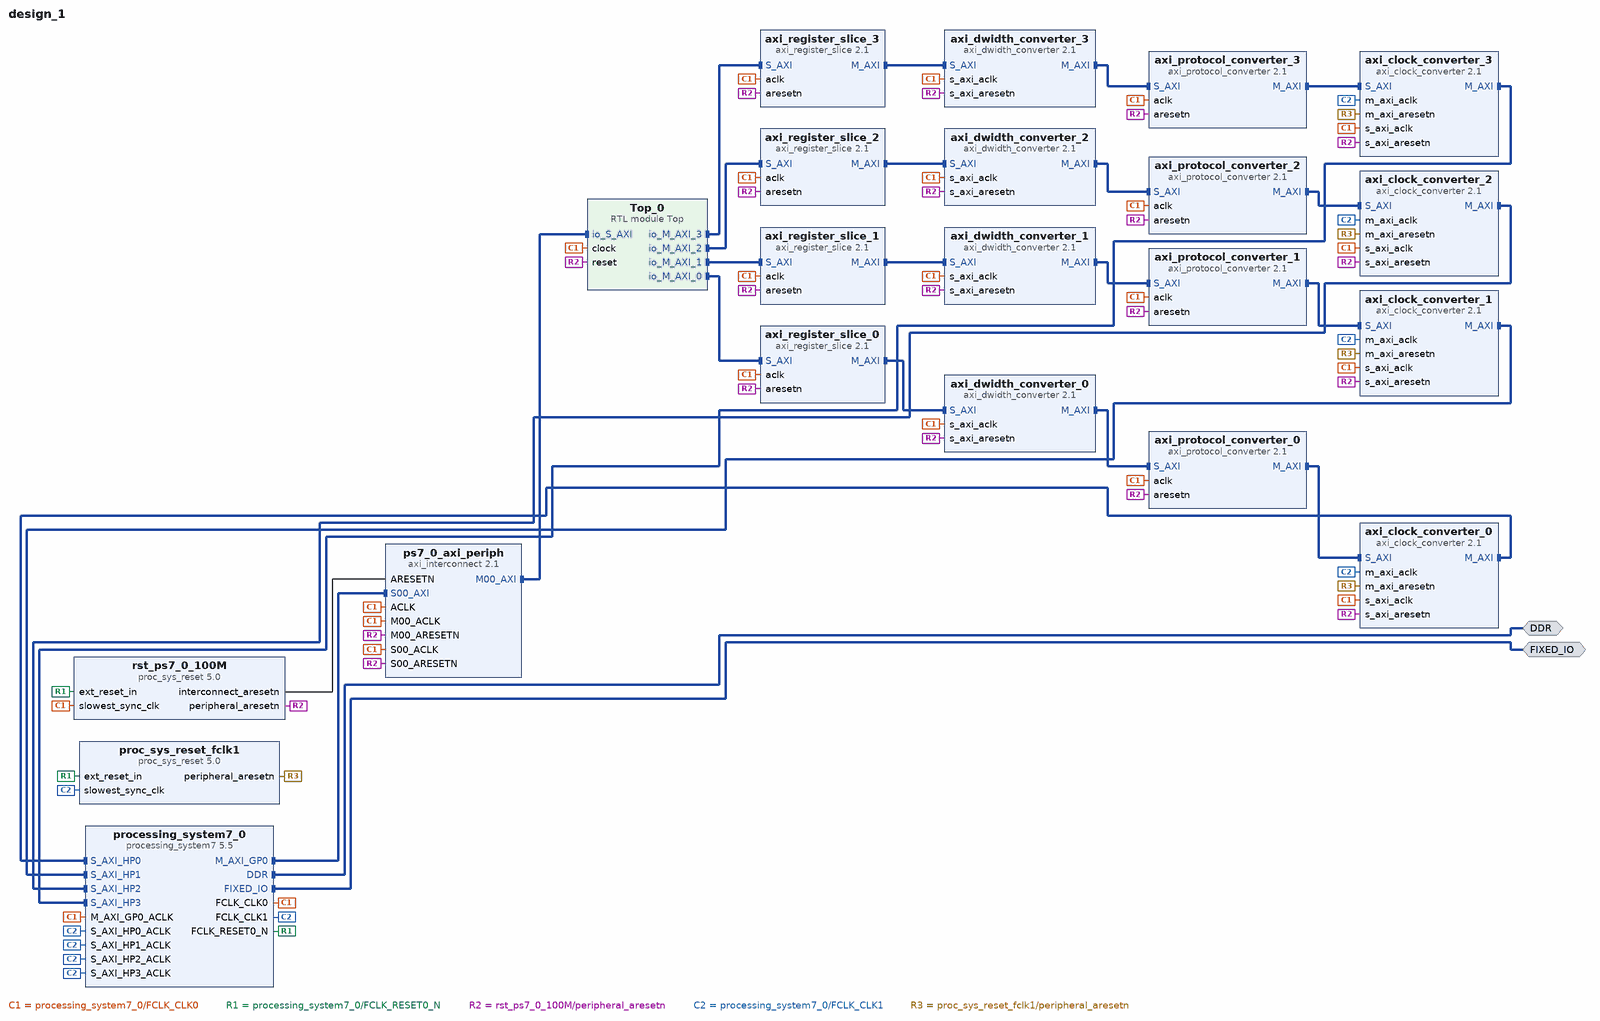
[diagram p0: block diagram of the top level]
# Vivado block design design_1, xc7z045ffg900-2, Vivado 2017.1
create_bd_design design_1

create_bd_intf_port -mode Master -vlnv xilinx.com:interface:ddrx_rtl:1.0 DDR
create_bd_intf_port -mode Master -vlnv xilinx.com:display_processing_system7:fixedio_rtl:1.0 FIXED_IO

create_bd_cell -type ip -vlnv xilinx.com:ip:processing_system7:5.5 processing_system7_0
set_property -dict [list \
  CONFIG.PCW_FPGA0_PERIPHERAL_FREQMHZ 100 \
  CONFIG.PCW_FPGA1_PERIPHERAL_FREQMHZ 250 \
  CONFIG.PCW_USE_S_AXI_HP0 1 \
  CONFIG.PCW_USE_S_AXI_HP1 1 \
  CONFIG.PCW_USE_S_AXI_HP2 1 \
  CONFIG.PCW_USE_S_AXI_HP3 1 \
  CONFIG.PCW_EN_CLK1_PORT 1 \
  CONFIG.preset ZC706 \
] [get_bd_cells processing_system7_0]
create_bd_cell -type module -reference Top Top_0
create_bd_cell -type ip -vlnv xilinx.com:ip:axi_interconnect:2.1 ps7_0_axi_periph
set_property -dict {CONFIG.NUM_MI 1} [get_bd_cells ps7_0_axi_periph]
create_bd_cell -type ip -vlnv xilinx.com:ip:proc_sys_reset:5.0 rst_ps7_0_100M
create_bd_cell -type ip -vlnv xilinx.com:ip:proc_sys_reset:5.0 proc_sys_reset_fclk1
create_bd_cell -type ip -vlnv xilinx.com:ip:axi_register_slice:2.1 axi_register_slice_0
create_bd_cell -type ip -vlnv xilinx.com:ip:axi_dwidth_converter:2.1 axi_dwidth_converter_0
set_property -dict [list \
  CONFIG.PROTOCOL AXI4 \
  CONFIG.READ_WRITE_MODE READ_WRITE \
  CONFIG.ADDR_WIDTH 32 \
  CONFIG.SI_DATA_WIDTH 512 \
  CONFIG.MI_DATA_WIDTH 64 \
  CONFIG.SI_ID_WIDTH 6 \
] [get_bd_cells axi_dwidth_converter_0]
create_bd_cell -type ip -vlnv xilinx.com:ip:axi_protocol_converter:2.1 axi_protocol_converter_0
set_property -dict [list \
  CONFIG.SI_PROTOCOL AXI4 \
  CONFIG.MI_PROTOCOL AXI3 \
  CONFIG.TRANSLATION_MODE 2 \
  CONFIG.DATA_WIDTH 64 \
  CONFIG.ID_WIDTH 6 \
] [get_bd_cells axi_protocol_converter_0]
create_bd_cell -type ip -vlnv xilinx.com:ip:axi_clock_converter:2.1 axi_clock_converter_0
set_property -dict [list \
  CONFIG.PROTOCOL AXI3 \
  CONFIG.READ_WRITE_MODE READ_WRITE \
  CONFIG.ADDR_WIDTH 32 \
  CONFIG.DATA_WIDTH 64 \
  CONFIG.ID_WIDTH 6 \
] [get_bd_cells axi_clock_converter_0]
create_bd_cell -type ip -vlnv xilinx.com:ip:axi_register_slice:2.1 axi_register_slice_1
create_bd_cell -type ip -vlnv xilinx.com:ip:axi_dwidth_converter:2.1 axi_dwidth_converter_1
set_property -dict [list \
  CONFIG.PROTOCOL AXI4 \
  CONFIG.READ_WRITE_MODE READ_WRITE \
  CONFIG.ADDR_WIDTH 32 \
  CONFIG.SI_DATA_WIDTH 512 \
  CONFIG.MI_DATA_WIDTH 64 \
  CONFIG.SI_ID_WIDTH 6 \
] [get_bd_cells axi_dwidth_converter_1]
create_bd_cell -type ip -vlnv xilinx.com:ip:axi_protocol_converter:2.1 axi_protocol_converter_1
set_property -dict [list \
  CONFIG.SI_PROTOCOL AXI4 \
  CONFIG.MI_PROTOCOL AXI3 \
  CONFIG.TRANSLATION_MODE 2 \
  CONFIG.DATA_WIDTH 64 \
  CONFIG.ID_WIDTH 6 \
] [get_bd_cells axi_protocol_converter_1]
create_bd_cell -type ip -vlnv xilinx.com:ip:axi_clock_converter:2.1 axi_clock_converter_1
set_property -dict [list \
  CONFIG.PROTOCOL AXI3 \
  CONFIG.READ_WRITE_MODE READ_WRITE \
  CONFIG.ADDR_WIDTH 32 \
  CONFIG.DATA_WIDTH 64 \
  CONFIG.ID_WIDTH 6 \
] [get_bd_cells axi_clock_converter_1]
create_bd_cell -type ip -vlnv xilinx.com:ip:axi_register_slice:2.1 axi_register_slice_2
create_bd_cell -type ip -vlnv xilinx.com:ip:axi_dwidth_converter:2.1 axi_dwidth_converter_2
set_property -dict [list \
  CONFIG.PROTOCOL AXI4 \
  CONFIG.READ_WRITE_MODE READ_WRITE \
  CONFIG.ADDR_WIDTH 32 \
  CONFIG.SI_DATA_WIDTH 512 \
  CONFIG.MI_DATA_WIDTH 64 \
  CONFIG.SI_ID_WIDTH 6 \
] [get_bd_cells axi_dwidth_converter_2]
create_bd_cell -type ip -vlnv xilinx.com:ip:axi_protocol_converter:2.1 axi_protocol_converter_2
set_property -dict [list \
  CONFIG.SI_PROTOCOL AXI4 \
  CONFIG.MI_PROTOCOL AXI3 \
  CONFIG.TRANSLATION_MODE 2 \
  CONFIG.DATA_WIDTH 64 \
  CONFIG.ID_WIDTH 6 \
] [get_bd_cells axi_protocol_converter_2]
create_bd_cell -type ip -vlnv xilinx.com:ip:axi_clock_converter:2.1 axi_clock_converter_2
set_property -dict [list \
  CONFIG.PROTOCOL AXI3 \
  CONFIG.READ_WRITE_MODE READ_WRITE \
  CONFIG.ADDR_WIDTH 32 \
  CONFIG.DATA_WIDTH 64 \
  CONFIG.ID_WIDTH 6 \
] [get_bd_cells axi_clock_converter_2]
create_bd_cell -type ip -vlnv xilinx.com:ip:axi_register_slice:2.1 axi_register_slice_3
create_bd_cell -type ip -vlnv xilinx.com:ip:axi_dwidth_converter:2.1 axi_dwidth_converter_3
set_property -dict [list \
  CONFIG.PROTOCOL AXI4 \
  CONFIG.READ_WRITE_MODE READ_WRITE \
  CONFIG.ADDR_WIDTH 32 \
  CONFIG.SI_DATA_WIDTH 512 \
  CONFIG.MI_DATA_WIDTH 64 \
  CONFIG.SI_ID_WIDTH 6 \
] [get_bd_cells axi_dwidth_converter_3]
create_bd_cell -type ip -vlnv xilinx.com:ip:axi_protocol_converter:2.1 axi_protocol_converter_3
set_property -dict [list \
  CONFIG.SI_PROTOCOL AXI4 \
  CONFIG.MI_PROTOCOL AXI3 \
  CONFIG.TRANSLATION_MODE 2 \
  CONFIG.DATA_WIDTH 64 \
  CONFIG.ID_WIDTH 6 \
] [get_bd_cells axi_protocol_converter_3]
create_bd_cell -type ip -vlnv xilinx.com:ip:axi_clock_converter:2.1 axi_clock_converter_3
set_property -dict [list \
  CONFIG.PROTOCOL AXI3 \
  CONFIG.READ_WRITE_MODE READ_WRITE \
  CONFIG.ADDR_WIDTH 32 \
  CONFIG.DATA_WIDTH 64 \
  CONFIG.ID_WIDTH 6 \
] [get_bd_cells axi_clock_converter_3]

# ---- connections ----

connect_bd_intf_net [get_bd_intf_pins processing_system7_0/M_AXI_GP0] [get_bd_intf_pins ps7_0_axi_periph/S00_AXI]
connect_bd_intf_net [get_bd_intf_pins ps7_0_axi_periph/M00_AXI] [get_bd_intf_pins Top_0/io_S_AXI]
connect_bd_intf_net [get_bd_intf_pins Top_0/io_M_AXI_0] [get_bd_intf_pins axi_register_slice_0/S_AXI]
connect_bd_intf_net [get_bd_intf_pins axi_register_slice_0/M_AXI] [get_bd_intf_pins axi_dwidth_converter_0/S_AXI]
connect_bd_intf_net [get_bd_intf_pins axi_dwidth_converter_0/M_AXI] [get_bd_intf_pins axi_protocol_converter_0/S_AXI]
connect_bd_intf_net [get_bd_intf_pins axi_protocol_converter_0/M_AXI] [get_bd_intf_pins axi_clock_converter_0/S_AXI]
connect_bd_intf_net [get_bd_intf_pins axi_clock_converter_0/M_AXI] [get_bd_intf_pins processing_system7_0/S_AXI_HP0]
connect_bd_intf_net [get_bd_intf_pins Top_0/io_M_AXI_1] [get_bd_intf_pins axi_register_slice_1/S_AXI]
connect_bd_intf_net [get_bd_intf_pins axi_register_slice_1/M_AXI] [get_bd_intf_pins axi_dwidth_converter_1/S_AXI]
connect_bd_intf_net [get_bd_intf_pins axi_dwidth_converter_1/M_AXI] [get_bd_intf_pins axi_protocol_converter_1/S_AXI]
connect_bd_intf_net [get_bd_intf_pins axi_protocol_converter_1/M_AXI] [get_bd_intf_pins axi_clock_converter_1/S_AXI]
connect_bd_intf_net [get_bd_intf_pins axi_clock_converter_1/M_AXI] [get_bd_intf_pins processing_system7_0/S_AXI_HP1]
connect_bd_intf_net [get_bd_intf_pins Top_0/io_M_AXI_2] [get_bd_intf_pins axi_register_slice_2/S_AXI]
connect_bd_intf_net [get_bd_intf_pins axi_register_slice_2/M_AXI] [get_bd_intf_pins axi_dwidth_converter_2/S_AXI]
connect_bd_intf_net [get_bd_intf_pins axi_dwidth_converter_2/M_AXI] [get_bd_intf_pins axi_protocol_converter_2/S_AXI]
connect_bd_intf_net [get_bd_intf_pins axi_protocol_converter_2/M_AXI] [get_bd_intf_pins axi_clock_converter_2/S_AXI]
connect_bd_intf_net [get_bd_intf_pins axi_clock_converter_2/M_AXI] [get_bd_intf_pins processing_system7_0/S_AXI_HP2]
connect_bd_intf_net [get_bd_intf_pins Top_0/io_M_AXI_3] [get_bd_intf_pins axi_register_slice_3/S_AXI]
connect_bd_intf_net [get_bd_intf_pins axi_register_slice_3/M_AXI] [get_bd_intf_pins axi_dwidth_converter_3/S_AXI]
connect_bd_intf_net [get_bd_intf_pins axi_dwidth_converter_3/M_AXI] [get_bd_intf_pins axi_protocol_converter_3/S_AXI]
connect_bd_intf_net [get_bd_intf_pins axi_protocol_converter_3/M_AXI] [get_bd_intf_pins axi_clock_converter_3/S_AXI]
connect_bd_intf_net [get_bd_intf_pins axi_clock_converter_3/M_AXI] [get_bd_intf_pins processing_system7_0/S_AXI_HP3]
connect_bd_intf_net [get_bd_intf_ports DDR] [get_bd_intf_pins processing_system7_0/DDR]
connect_bd_intf_net [get_bd_intf_ports FIXED_IO] [get_bd_intf_pins processing_system7_0/FIXED_IO]
connect_bd_net [get_bd_pins processing_system7_0/FCLK_CLK0] \
  [get_bd_pins ps7_0_axi_periph/ACLK] [get_bd_pins processing_system7_0/M_AXI_GP0_ACLK] \
  [get_bd_pins ps7_0_axi_periph/S00_ACLK] [get_bd_pins rst_ps7_0_100M/slowest_sync_clk] [get_bd_pins Top_0/clock] \
  [get_bd_pins ps7_0_axi_periph/M00_ACLK] [get_bd_pins axi_register_slice_0/aclk] \
  [get_bd_pins axi_dwidth_converter_0/s_axi_aclk] [get_bd_pins axi_protocol_converter_0/aclk] \
  [get_bd_pins axi_clock_converter_0/s_axi_aclk] [get_bd_pins axi_register_slice_1/aclk] \
  [get_bd_pins axi_dwidth_converter_1/s_axi_aclk] [get_bd_pins axi_protocol_converter_1/aclk] \
  [get_bd_pins axi_clock_converter_1/s_axi_aclk] [get_bd_pins axi_register_slice_2/aclk] \
  [get_bd_pins axi_dwidth_converter_2/s_axi_aclk] [get_bd_pins axi_protocol_converter_2/aclk] \
  [get_bd_pins axi_clock_converter_2/s_axi_aclk] [get_bd_pins axi_register_slice_3/aclk] \
  [get_bd_pins axi_dwidth_converter_3/s_axi_aclk] [get_bd_pins axi_protocol_converter_3/aclk] \
  [get_bd_pins axi_clock_converter_3/s_axi_aclk]
connect_bd_net [get_bd_pins processing_system7_0/FCLK_RESET0_N] \
  [get_bd_pins rst_ps7_0_100M/ext_reset_in] [get_bd_pins proc_sys_reset_fclk1/ext_reset_in]
connect_bd_net [get_bd_pins rst_ps7_0_100M/peripheral_aresetn] \
  [get_bd_pins ps7_0_axi_periph/S00_ARESETN] [get_bd_pins Top_0/reset] [get_bd_pins ps7_0_axi_periph/M00_ARESETN] \
  [get_bd_pins axi_register_slice_0/aresetn] [get_bd_pins axi_dwidth_converter_0/s_axi_aresetn] \
  [get_bd_pins axi_protocol_converter_0/aresetn] [get_bd_pins axi_clock_converter_0/s_axi_aresetn] \
  [get_bd_pins axi_register_slice_1/aresetn] [get_bd_pins axi_dwidth_converter_1/s_axi_aresetn] \
  [get_bd_pins axi_protocol_converter_1/aresetn] [get_bd_pins axi_clock_converter_1/s_axi_aresetn] \
  [get_bd_pins axi_register_slice_2/aresetn] [get_bd_pins axi_dwidth_converter_2/s_axi_aresetn] \
  [get_bd_pins axi_protocol_converter_2/aresetn] [get_bd_pins axi_clock_converter_2/s_axi_aresetn] \
  [get_bd_pins axi_register_slice_3/aresetn] [get_bd_pins axi_dwidth_converter_3/s_axi_aresetn] \
  [get_bd_pins axi_protocol_converter_3/aresetn] [get_bd_pins axi_clock_converter_3/s_axi_aresetn]
connect_bd_net [get_bd_pins rst_ps7_0_100M/interconnect_aresetn] [get_bd_pins ps7_0_axi_periph/ARESETN]
connect_bd_net [get_bd_pins processing_system7_0/FCLK_CLK1] \
  [get_bd_pins proc_sys_reset_fclk1/slowest_sync_clk] [get_bd_pins processing_system7_0/S_AXI_HP0_ACLK] \
  [get_bd_pins axi_clock_converter_0/m_axi_aclk] [get_bd_pins processing_system7_0/S_AXI_HP1_ACLK] \
  [get_bd_pins axi_clock_converter_1/m_axi_aclk] [get_bd_pins processing_system7_0/S_AXI_HP2_ACLK] \
  [get_bd_pins axi_clock_converter_2/m_axi_aclk] [get_bd_pins processing_system7_0/S_AXI_HP3_ACLK] \
  [get_bd_pins axi_clock_converter_3/m_axi_aclk]
connect_bd_net [get_bd_pins proc_sys_reset_fclk1/peripheral_aresetn] \
  [get_bd_pins axi_clock_converter_0/m_axi_aresetn] [get_bd_pins axi_clock_converter_1/m_axi_aresetn] \
  [get_bd_pins axi_clock_converter_2/m_axi_aresetn] [get_bd_pins axi_clock_converter_3/m_axi_aresetn]

# ---- address map ----
assign_bd_address -offset 0x40000000 -range 1G -target_address_space [get_bd_addr_spaces processing_system7_0/Data] [get_bd_addr_segs Top_0/io_S_AXI/reg0]
assign_bd_address -offset 0x00000000 -range 1G -target_address_space [get_bd_addr_spaces Top_0/io_M_AXI_0] [get_bd_addr_segs processing_system7_0/S_AXI_HP0/HP0_DDR_LOWOCM]
assign_bd_address -offset 0x00000000 -range 1G -target_address_space [get_bd_addr_spaces Top_0/io_M_AXI_1] [get_bd_addr_segs processing_system7_0/S_AXI_HP1/HP1_DDR_LOWOCM]
assign_bd_address -offset 0x00000000 -range 1G -target_address_space [get_bd_addr_spaces Top_0/io_M_AXI_2] [get_bd_addr_segs processing_system7_0/S_AXI_HP2/HP2_DDR_LOWOCM]
assign_bd_address -offset 0x00000000 -range 1G -target_address_space [get_bd_addr_spaces Top_0/io_M_AXI_3] [get_bd_addr_segs processing_system7_0/S_AXI_HP3/HP3_DDR_LOWOCM]

validate_bd_design
save_bd_design
